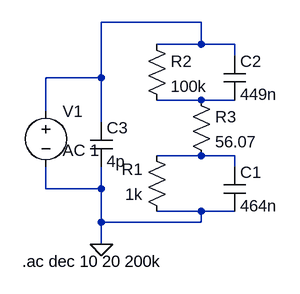
[diagram p0: schematic Draft1.asc]
Draft1.asc, the LTspice schematic file:
Version 4
SHEET 1 880 680
WIRE 160 -80 16 -80
WIRE 160 -48 160 -80
WIRE 160 -48 96 -48
WIRE 208 -48 160 -48
WIRE 208 -32 208 -48
WIRE 16 0 16 -80
WIRE 16 0 -64 0
WIRE 160 32 96 32
WIRE 208 32 160 32
WIRE -64 48 -64 0
WIRE 16 64 16 0
WIRE 160 112 96 112
WIRE 208 112 160 112
WIRE 208 128 208 112
WIRE -64 160 -64 128
WIRE 16 160 16 128
WIRE 16 160 -64 160
WIRE 160 192 96 192
WIRE 208 192 160 192
WIRE 16 208 16 160
WIRE 160 208 160 192
WIRE 160 208 16 208
WIRE 16 240 16 208
FLAG 16 240 0
SYMBOL cap 192 128 R0
SYMATTR InstName C1
SYMATTR Value 464n
SYMBOL res 112 208 R180
WINDOW 0 36 76 Left 2
WINDOW 3 36 40 Left 2
SYMATTR InstName R1
SYMATTR Value 1k
SYMBOL res 80 -64 R0
SYMATTR InstName R2
SYMATTR Value 100k
SYMBOL cap 192 -32 R0
SYMATTR InstName C2
SYMATTR Value 449n
SYMBOL res 144 16 R0
SYMATTR InstName R3
SYMATTR Value 56.07
SYMBOL cap 0 64 R0
SYMATTR InstName C3
SYMATTR Value 4p
SYMBOL voltage -64 32 R0
WINDOW 3 24 44 Left 2
WINDOW 123 24 72 Left 2
WINDOW 39 0 0 Left 0
SYMATTR InstName V1
SYMATTR Value ""
SYMATTR Value2 AC 1
TEXT -98 264 Left 2 !.ac dec 10 20 200k

The netlist it stands for:
* Draft1.asc
C1 N003 0 464n
R1 0 N003 1k
R2 N001 N002 100k
C2 N001 N002 449n
R3 N002 N003 56.07
C3 N001 0 4p
V1 N001 0 AC 1
.ac dec 10 20 200k
.backanno
.end